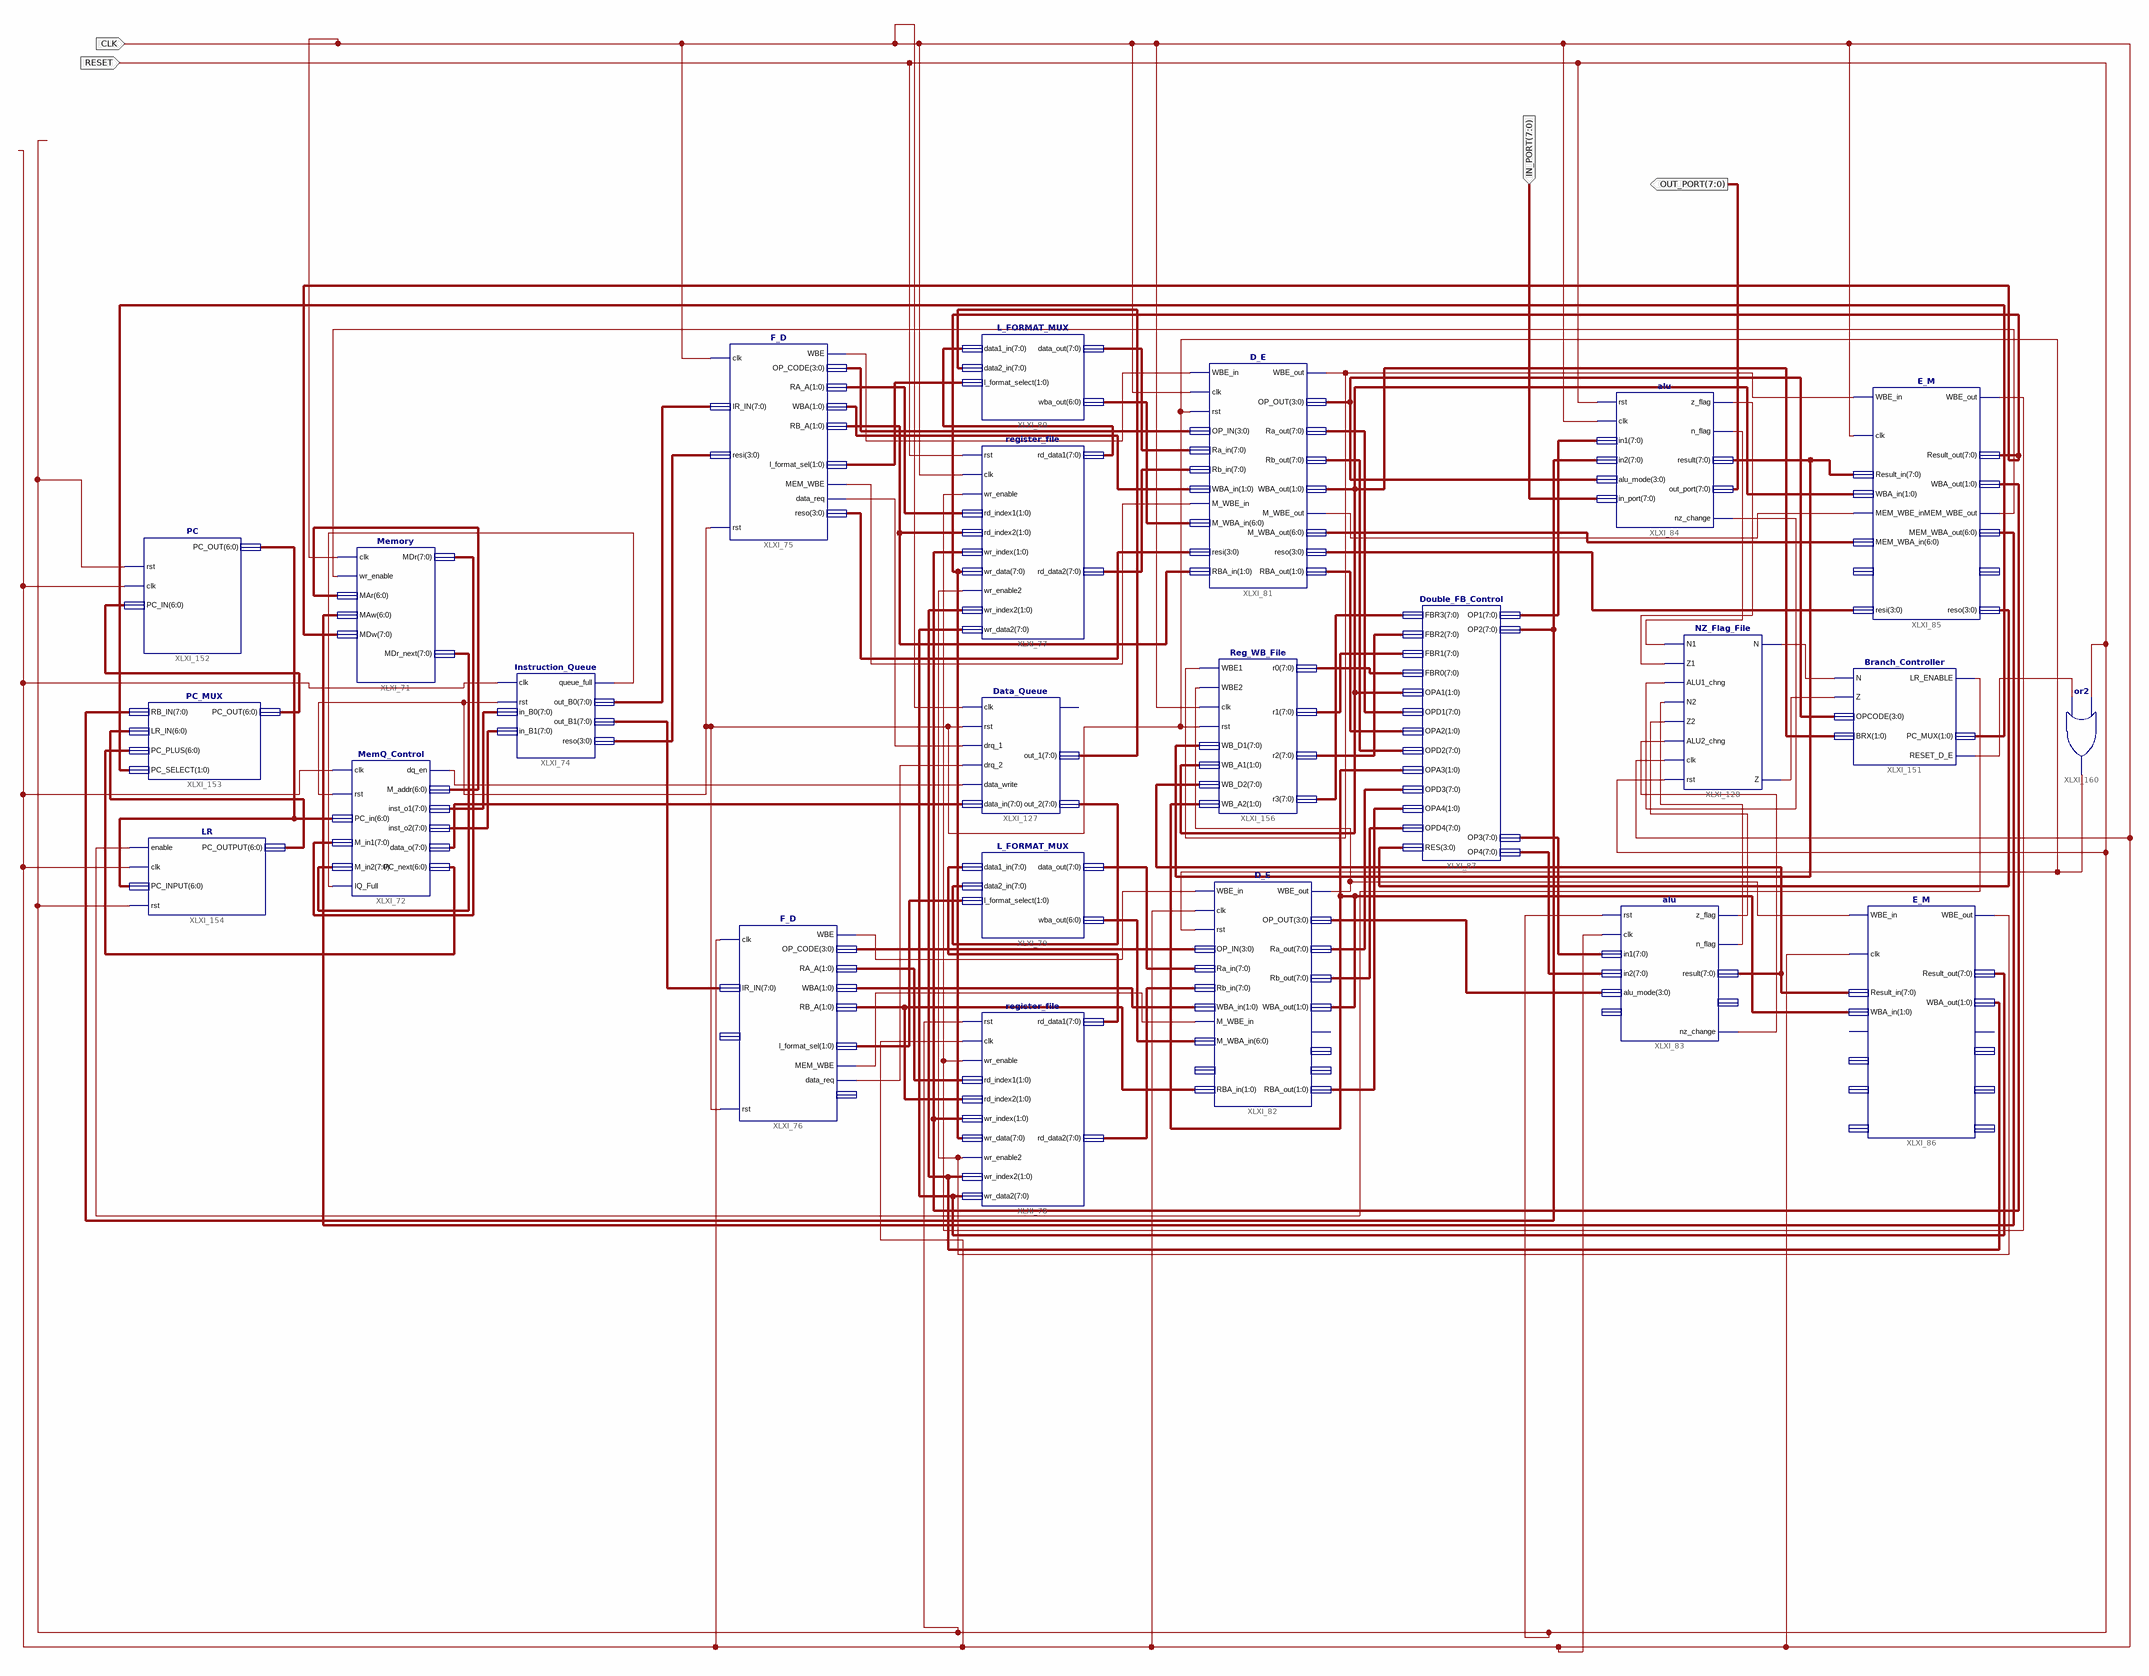
[diagram p0: schematic sheet 1]
// Xilinx ISE schematic CPU.sch (spartan3e) as structural Verilog: 24 symbols, 4 ports
module CPU (
  input  RESET,
  input  [7:0] IN_PORT,
  input  CLK,
  output [7:0] OUT_PORT
);

  wire XLXN_465, XLXN_466, XLXN_471, XLXN_484, XLXN_485, XLXN_499, XLXN_503, XLXN_511, XLXN_512, XLXN_513,
       XLXN_514, XLXN_515, XLXN_516, XLXN_519, XLXN_523, XLXN_527, XLXN_532, XLXN_536, XLXN_548, XLXN_549,
       XLXN_550, XLXN_553, XLXN_554, XLXN_581, XLXN_599;
  wire [1:0] XLXN_473, XLXN_474, XLXN_475, XLXN_476, XLXN_500, XLXN_502, XLXN_518, XLXN_524, XLXN_526,
       XLXN_529, XLXN_530, XLXN_538, XLXN_544, XLXN_552, XLXN_557;
  wire [3:0] XLXN_469, XLXN_472, XLXN_486, XLXN_490, XLXN_510, XLXN_522, XLXN_528, XLXN_545;
  wire [6:0] XLXN_454, XLXN_457, XLXN_458, XLXN_459, XLXN_461, XLXN_478, XLXN_498, XLXN_520, XLXN_537;
  wire [7:0] XLXN_455, XLXN_456, XLXN_462, XLXN_463, XLXN_464, XLXN_467, XLXN_468, XLXN_481, XLXN_487,
       XLXN_488, XLXN_489, XLXN_495, XLXN_496, XLXN_501, XLXN_504, XLXN_505, XLXN_506, XLXN_507, XLXN_508,
       XLXN_521, XLXN_525, XLXN_531, XLXN_533, XLXN_534, XLXN_535, XLXN_540, XLXN_542, XLXN_546, XLXN_547,
       XLXN_555, XLXN_556;

  L_FORMAT_MUX XLXI_80 (
    .data1_in(XLXN_487), .data2_in(XLXN_488), .data_out(XLXN_481), .l_format_select(XLXN_476),
    .wba_out(XLXN_478));
  D_E XLXI_81 (
    .WBE_in(XLXN_471), .M_WBE_in(XLXN_484), .clk(CLK), .rst(XLXN_599), .OP_IN(XLXN_472), .Ra_in(XLXN_481),
    .Rb_in(XLXN_489), .WBA_in(XLXN_475), .M_WBA_in(XLXN_478), .resi(XLXN_486), .WBE_out(XLXN_503),
    .M_WBE_out(XLXN_499), .OP_OUT(XLXN_510), .Ra_out(XLXN_495), .Rb_out(XLXN_496), .WBA_out(XLXN_502),
    .M_WBA_out(XLXN_498), .reso(XLXN_490), .RBA_in(XLXN_474), .RBA_out(XLXN_500));
  F_D XLXI_75 (
    .clk(CLK), .rst(XLXN_599), .IR_IN(XLXN_467), .resi(XLXN_469), .WBE(XLXN_471), .MEM_WBE(XLXN_484),
    .data_req(XLXN_485), .OP_CODE(XLXN_472), .RA_A(XLXN_473), .WBA(XLXN_475), .RB_A(XLXN_474),
    .l_format_sel(XLXN_476), .reso(XLXN_486));
  E_M XLXI_85 (
    .WBE_in(XLXN_503), .MEM_WBE_in(XLXN_499), .clk(CLK), .Result_in(XLXN_501), .WBA_in(XLXN_502),
    .WBE_out(XLXN_516), .MEM_WBE_out(XLXN_519), .Result_out(XLXN_521), .WBA_out(XLXN_518),
    .MEM_WBA_out(XLXN_520), .resi(XLXN_490), .reso(XLXN_522), .MEM_WBA_in(XLXN_498));  // open: RBA_in, RBA_out
  F_D XLXI_76 (
    .clk(CLK), .rst(XLXN_599), .IR_IN(XLXN_468), .WBE(XLXN_527), .MEM_WBE(XLXN_536), .data_req(XLXN_532),
    .OP_CODE(XLXN_528), .RA_A(XLXN_529), .WBA(XLXN_538), .RB_A(XLXN_530), .l_format_sel(XLXN_526));  // open: resi, reso
  L_FORMAT_MUX XLXI_79 (
    .data1_in(XLXN_531), .data2_in(XLXN_533), .data_out(XLXN_534), .l_format_select(XLXN_526),
    .wba_out(XLXN_537));
  D_E XLXI_82 (
    .WBE_in(XLXN_527), .M_WBE_in(XLXN_536), .clk(CLK), .rst(XLXN_599), .OP_IN(XLXN_528), .Ra_in(XLXN_534),
    .Rb_in(XLXN_535), .WBA_in(XLXN_538), .M_WBA_in(XLXN_537), .WBE_out(XLXN_553), .OP_OUT(XLXN_545),
    .Ra_out(XLXN_540), .Rb_out(XLXN_542), .WBA_out(XLXN_552), .RBA_in(XLXN_530), .RBA_out(XLXN_544));  // open: resi, M_WBE_out, M_WBA_out, reso
  E_M XLXI_86 (
    .WBE_in(XLXN_553), .clk(CLK), .Result_in(XLXN_555), .WBA_in(XLXN_552), .WBE_out(XLXN_554),
    .Result_out(XLXN_556), .WBA_out(XLXN_557));  // open: MEM_WBE_in, MEM_WBE_out, MEM_WBA_out, RBA_in, resi, RBA_out, reso, MEM_WBA_in
  Data_Queue XLXI_127 (
    .clk(CLK), .rst(XLXN_599), .drq_1(XLXN_485), .drq_2(XLXN_532), .data_write(XLXN_465), .data_in(XLXN_464),
    .out_1(XLXN_488), .out_2(XLXN_533));  // open: queue_full
  register_file XLXI_77 (
    .rst(RESET), .clk(CLK), .wr_enable(XLXN_516), .rd_index1(XLXN_473), .rd_index2(XLXN_474),
    .wr_index(XLXN_518), .wr_data(XLXN_521), .rd_data1(XLXN_487), .rd_data2(XLXN_489), .wr_enable2(XLXN_554),
    .wr_index2(XLXN_557), .wr_data2(XLXN_556));
  register_file XLXI_78 (
    .rst(RESET), .clk(CLK), .wr_enable(XLXN_516), .rd_index1(XLXN_529), .rd_index2(XLXN_530),
    .wr_index(XLXN_518), .wr_data(XLXN_521), .rd_data1(XLXN_531), .rd_data2(XLXN_535), .wr_enable2(XLXN_554),
    .wr_index2(XLXN_557), .wr_data2(XLXN_556));
  Double_FB_Control XLXI_87 (
    .FBR2(XLXN_506), .FBR1(XLXN_505), .FBR0(XLXN_504), .FBR3(XLXN_507), .OP1(XLXN_508), .OP2(XLXN_525),
    .OPA1(XLXN_502), .OPD1(XLXN_495), .OPA2(XLXN_500), .OPD2(XLXN_496), .OPA3(XLXN_552), .OPD3(XLXN_540),
    .OPA4(XLXN_544), .OPD4(XLXN_542), .RES(XLXN_522), .OP3(XLXN_546), .OP4(XLXN_547));
  alu XLXI_84 (
    .rst(RESET), .clk(CLK), .in1(XLXN_508), .in2(XLXN_525), .alu_mode(XLXN_510), .in_port(IN_PORT),
    .z_flag(XLXN_511), .n_flag(XLXN_512), .result(XLXN_501), .out_port(OUT_PORT), .nz_change(XLXN_513));
  alu XLXI_83 (
    .rst(RESET), .clk(CLK), .in1(XLXN_546), .in2(XLXN_547), .alu_mode(XLXN_545), .z_flag(XLXN_548),
    .n_flag(XLXN_549), .result(XLXN_555), .nz_change(XLXN_550));  // open: in_port, out_port
  Memory XLXI_71 (
    .clk(CLK), .wr_enable(XLXN_519), .MAr(XLXN_454), .MAw(XLXN_520), .MDw(XLXN_521), .MDr(XLXN_455),
    .MDr_next(XLXN_456));
  MemQ_Control XLXI_72 (
    .clk(CLK), .rst(XLXN_599), .PC_in(XLXN_457), .M_in1(XLXN_455), .M_in2(XLXN_456), .dq_en(XLXN_465),
    .M_addr(XLXN_454), .inst_o1(XLXN_462), .inst_o2(XLXN_463), .data_o(XLXN_464), .PC_next(XLXN_459),
    .IQ_Full(XLXN_466));
  Instruction_Queue XLXI_74 (
    .clk(CLK), .queue_full(XLXN_466), .out_B0(XLXN_467), .out_B1(XLXN_468), .reso(XLXN_469), .rst(XLXN_599),
    .in_B0(XLXN_462), .in_B1(XLXN_463));
  PC XLXI_152 (.rst(RESET), .clk(CLK), .PC_IN(XLXN_458), .PC_OUT(XLXN_457));
  PC_MUX XLXI_153 (.RB_IN(XLXN_525), .LR_IN(XLXN_461), .PC_PLUS(XLXN_459), .PC_SELECT(XLXN_524), .PC_OUT(XLXN_458));
  LR XLXI_154 (.enable(XLXN_523), .clk(CLK), .rst(RESET), .PC_INPUT(XLXN_457), .PC_OUTPUT(XLXN_461));
  NZ_Flag_File XLXI_128 (
    .N1(XLXN_512), .Z1(XLXN_511), .ALU1_chng(XLXN_513), .N2(XLXN_549), .Z2(XLXN_548), .ALU2_chng(XLXN_550),
    .clk(CLK), .rst(RESET), .N(XLXN_514), .Z(XLXN_515));
  Branch_Controller XLXI_151 (
    .N(XLXN_514), .Z(XLXN_515), .OPCODE(XLXN_510), .BRX(XLXN_502), .LR_ENABLE(XLXN_523),
    .RESET_D_E(XLXN_581), .PC_MUX(XLXN_524));
  Reg_WB_File XLXI_156 (
    .WBE1(XLXN_503), .WBE2(XLXN_553), .clk(CLK), .rst(XLXN_599), .WB_D1(XLXN_501), .WB_A1(XLXN_502),
    .WB_D2(XLXN_555), .WB_A2(XLXN_552), .r0(XLXN_504), .r1(XLXN_505), .r2(XLXN_506), .r3(XLXN_507));
  or XLXI_160 (XLXN_599, XLXN_581, RESET);
endmodule
